# Altium project FLIGHTUmbilicalBoard_Rev1.PrjPcb
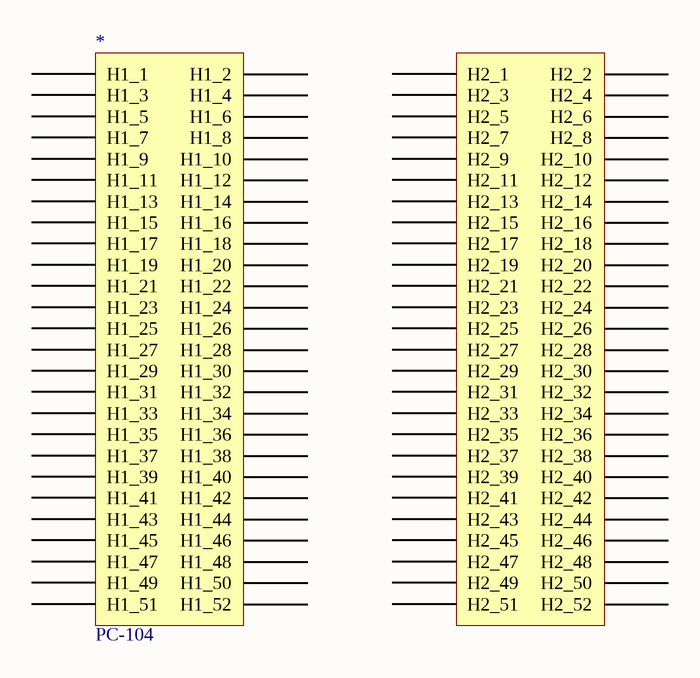
[diagram p0: PC104 Header.SchDoc]
12 sheets, 78 parts. Net scope: flat (ports and power ports of the same name join across sheets).
Board file: FLIGHTUmbilicalBoard_Rev1.PcbDoc
Sheets:
  PC104 Header.SchDoc
  TopSheet.SchDoc
  DCDC.SchDoc
  Propulsion.SchDoc
  ADCS.SchDoc
  Docking.SchDoc
  FlightComputer.SchDoc
  Rockblock.SchDoc
  CDGPS.SchDoc
  EPS.SchDoc
  IMU.SchDoc
  BarrelJack.SchDoc

## Sheet PC104 Header.SchDoc
size B

### Parts
*  PC-104  [PC-104FOOTPRINT]

### Nets

Not connected (* = marked no-connect by the designer): * H1_1 H1_2 H1_3 H1_4 H1_5 H1_6 H1_7 H1_8 H1_9 H1_10 H1_11 H1_12 H1_13 H1_14 H1_15 H1_16 H1_17 H1_18 H1_19 H1_20 H1_21 H1_22 H1_23 H1_24 H1_25 H1_26 H1_27 H1_28 H1_29 H1_30 H1_31 H1_32 H1_33 H1_34 H1_35 H1_36 H1_37 H1_38 H1_39 H1_40 H1_41 H1_42 H1_43 H1_44 H1_45 H1_46 H1_47 H1_48 H1_49 H1_50 H1_51 H1_52 H2_1 H2_2 H2_3 H2_4 H2_5 H2_6 H2_7 H2_8 H2_9 H2_10 H2_11 H2_12 H2_13 H2_14 H2_15 H2_16 H2_17 H2_18 H2_19 H2_20 H2_21 H2_22 H2_23 H2_24 H2_25 H2_26 H2_27 H2_28 H2_29 H2_30 H2_31 H2_32 H2_33 H2_34 H2_35 H2_36 H2_37 H2_38 H2_39 H2_40 H2_41 H2_42 H2_43 H2_44 H2_45 H2_46 H2_47 H2_48 H2_49 H2_50 H2_51 H2_52

## Sheet TopSheet.SchDoc: TopSheet
size A3; Author: Leah Forrest; CompanyName: Cornell SSDS; Organization: Cornell OAAN
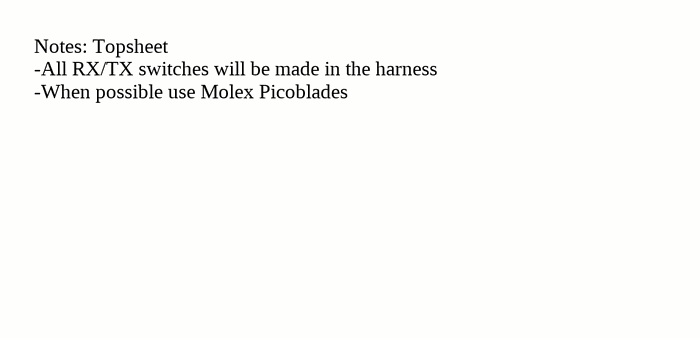
[diagram p1: TopSheet.SchDoc]

### Notes on the sheet
- Notes: Topsheet
  -All RX/TX switches will be made in the harness
  -When possible use Molex Picoblades
- Title
- Size:
- Date:
- A3
- Number:
- Time:
- Revision:
- Sheet
- of
- File:

## Sheet DCDC.SchDoc
size D
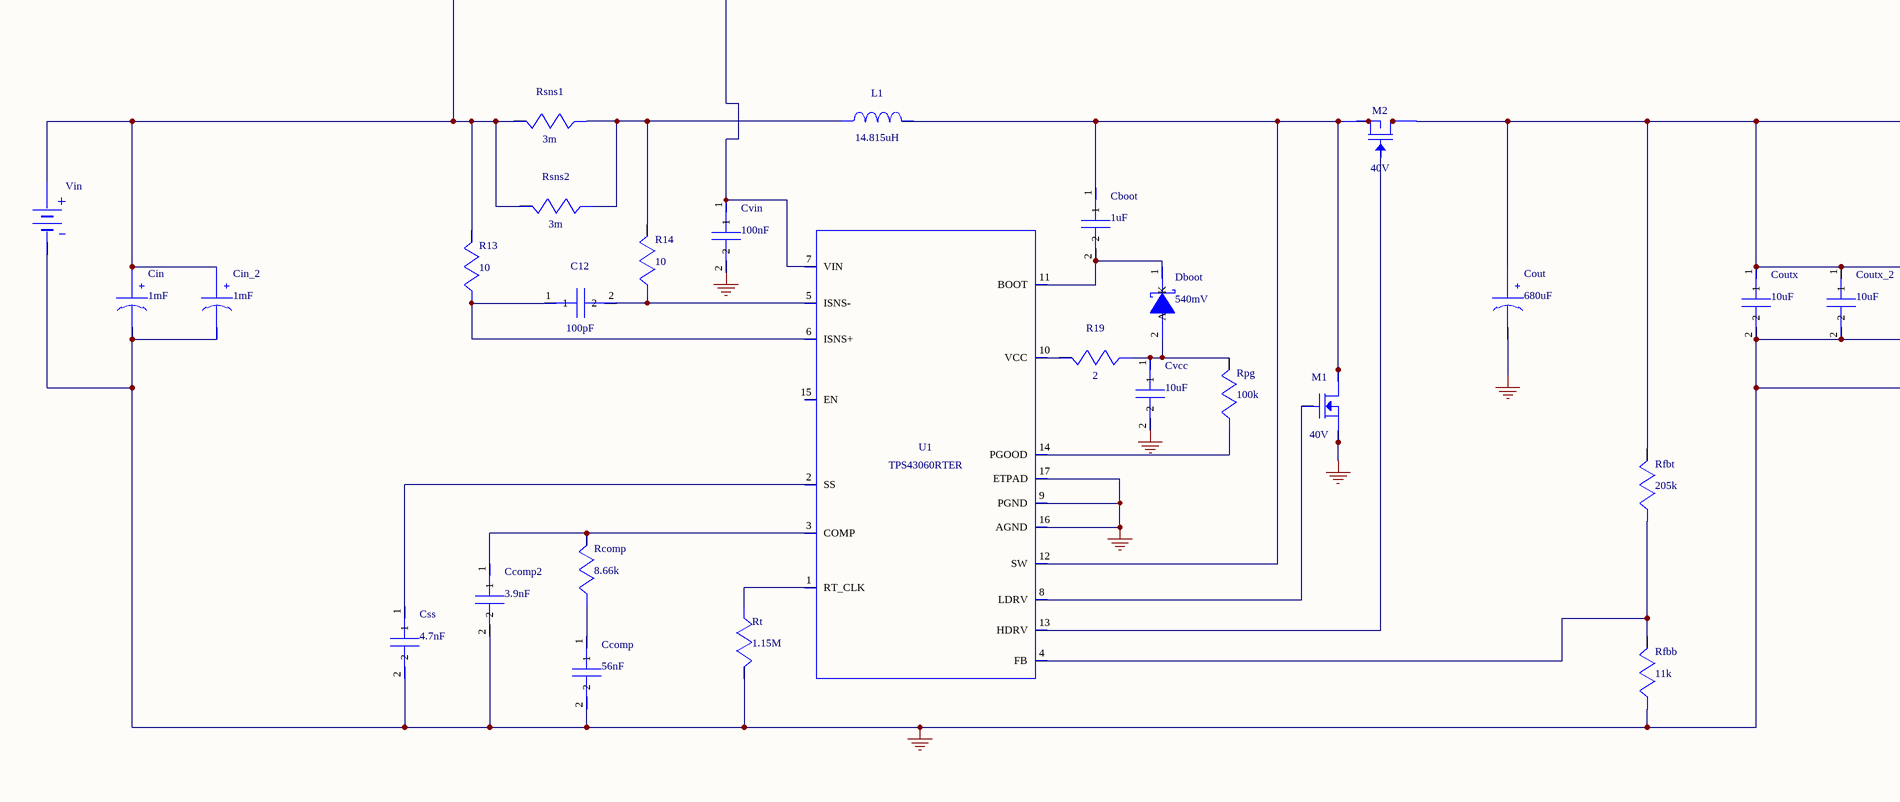
[diagram p2: DCDC.SchDoc, left]
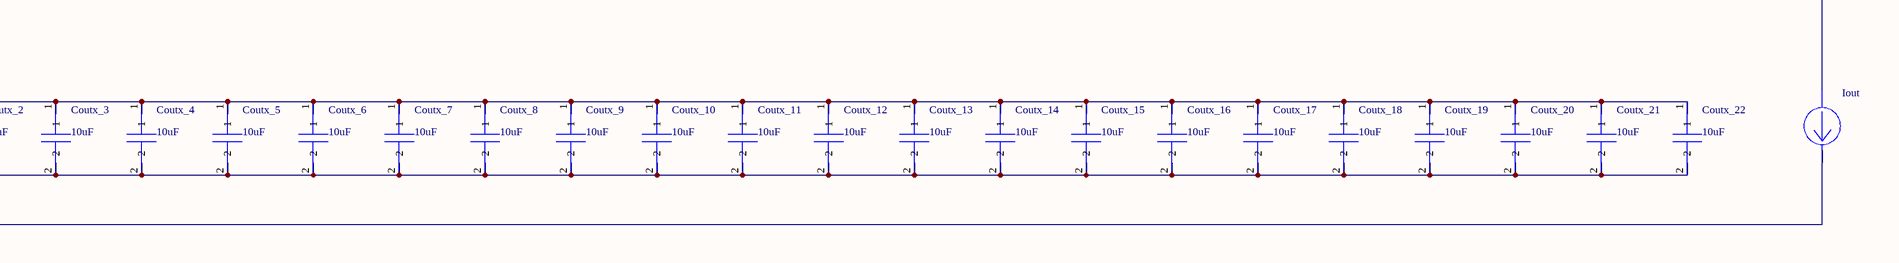
[diagram p3: DCDC.SchDoc, right]

### Parts
C12  value 100pF  (hidden comment: 06035A101JAT2A)
Cboot  value 1uF  (hidden comment: GRM188R61C105KA93D)
Ccomp  value 56nF  (hidden comment: GRM155R61A563KA01D)
Ccomp2  value 3.9nF  (hidden comment: CC0805KRX7R9BB392)
Cin  value 1mF  (hidden comment: 16SVPF1000M)
Cin_2  value 1mF  (hidden comment: 16SVPF1000M)
Cout  value 680uF  (hidden comment: EEV-FK1H681M)
Coutx  value 10uF  (hidden comment: C3216JB1H106K)
Coutx_2  value 10uF  (hidden comment: C3216JB1H106K)
Coutx_3  value 10uF  (hidden comment: C3216JB1H106K)
Coutx_4  value 10uF  (hidden comment: C3216JB1H106K)
Coutx_5  value 10uF  (hidden comment: C3216JB1H106K)
Coutx_6  value 10uF  (hidden comment: C3216JB1H106K)
Coutx_7  value 10uF  (hidden comment: C3216JB1H106K)
Coutx_8  value 10uF  (hidden comment: C3216JB1H106K)
Coutx_9  value 10uF  (hidden comment: C3216JB1H106K)
Coutx_10  value 10uF  (hidden comment: C3216JB1H106K)
Coutx_11  value 10uF  (hidden comment: C3216JB1H106K)
Coutx_12  value 10uF  (hidden comment: C3216JB1H106K)
Coutx_13  value 10uF  (hidden comment: C3216JB1H106K)
Coutx_14  value 10uF  (hidden comment: C3216JB1H106K)
Coutx_15  value 10uF  (hidden comment: C3216JB1H106K)
Coutx_16  value 10uF  (hidden comment: C3216JB1H106K)
Coutx_17  value 10uF  (hidden comment: C3216JB1H106K)
Coutx_18  value 10uF  (hidden comment: C3216JB1H106K)
Coutx_19  value 10uF  (hidden comment: C3216JB1H106K)
Coutx_20  value 10uF  (hidden comment: C3216JB1H106K)
Coutx_21  value 10uF  (hidden comment: C3216JB1H106K)
Coutx_22  value 10uF  (hidden comment: C3216JB1H106K)
Css  value 4.7nF  (hidden comment: GRM188R71E472KA01D)
Cvcc  value 10uF  (hidden comment: GRM188R61C106MA73D)
Cvin  value 100nF  (hidden comment: 08053C104KAT2A)
Dboot  value 540mV  (hidden comment: XBS104S13R-G)
Iout  WB_CURRENT_LOAD  (value not drawn)
L1  value 14.815uH  (hidden comment: GENERIC_INDUCTOR)
M1  value 40V  (hidden comment: FDMS8460)
M2  value 40V  (hidden comment: CSD18509Q5B)
R13  value 10  (hidden comment: CRCW040210R0FKED)
R14  value 10  (hidden comment: CRCW040210R0FKED)
R19  value 2  (hidden comment: CRCW04022R00FKED)
Rcomp  value 8.66k  (hidden comment: CRCW04028K66FKED)
Rfbb  value 11k  (hidden comment: CRCW040211K0FKED)
Rfbt  value 205k  (hidden comment: CRCW0402205KFKED)
Rpg  value 100k  (hidden comment: CRCW0402100KFKED)
Rsns1  value 3m  (hidden comment: WSR33L000FEA)
Rsns2  value 3m  (hidden comment: WSR33L000FEA)
Rt  value 1.15M  (hidden comment: CRCW04021M15FKED)
U1  TPS43060RTER
Vin  WB_BATTERY  (value not drawn)

### Nets
0: Ccomp.2 Ccomp2.2 Cin.2(-) Cin_2.2(-) Cout.2(-) Coutx.2 Coutx_2.2 Coutx_3.2 Coutx_4.2 Coutx_5.2 Coutx_6.2 Coutx_7.2 Coutx_8.2 Coutx_9.2 Coutx_10.2 Coutx_11.2 Coutx_12.2 Coutx_13.2 Coutx_14.2 Coutx_15.2 Coutx_16.2 Coutx_17.2 Coutx_18.2 Coutx_19.2 Coutx_20.2 Coutx_21.2 Coutx_22.2 Css.2 Cvcc.2 Cvin.2 Iout.2(-) M1.1(Source) M1.2(Source) M1.3(Source) Rfbb.2 Rt.1 U1.9(PGND) U1.16(AGND) U1.17(ETPAD) Vin.2(-)
NetC12_1: C12.1 R13.2 U1.6(ISNS+)
NetC12_2: C12.2 R14.2 U1.5(ISNS-)
NetCboot_1: Cboot.1 L1.1 M1.5(Drain) M1.6(Drain) M1.7(Drain) M1.8(Drain) U1.12(SW)
NetCboot_2: Cboot.2 Dboot.1(K) U1.11(BOOT)
NetCcomp2_1: Ccomp2.1 Rcomp.1 U1.3(COMP)
NetCcomp_1: Ccomp.1 Rcomp.2
NetCin_1: Cin.1(+) Cin_2.1(+) Cvin.1 R13.1 Rsns1.1 Rsns2.1 U1.7(VIN) Vin.1(+)
NetCout_1: Cout.1(+) Coutx.1 Coutx_2.1 Coutx_3.1 Coutx_4.1 Coutx_5.1 Coutx_6.1 Coutx_7.1 Coutx_8.1 Coutx_9.1 Coutx_10.1 Coutx_11.1 Coutx_12.1 Coutx_13.1 Coutx_14.1 Coutx_15.1 Coutx_16.1 Coutx_17.1 Coutx_18.1 Coutx_19.1 Coutx_20.1 Coutx_21.1 Coutx_22.1 Iout.1(+) Rfbt.1
NetCss_1: Css.1 U1.2(SS)
NetCvcc_1: Cvcc.1 Dboot.2(A) R19.2 Rpg.1
NetL1_2: L1.2 R14.1 Rsns1.2 Rsns2.2
NetM1_4: M1.4(Gate) U1.8(LDRV)
NetM2_1: M2.1(Source) M2.2(Source) M2.3(Source)
NetM2_4: M2.4(Gate) U1.13(HDRV)
NetM2_5: M2.5(Drain) M2.6(Drain) M2.7(Drain) M2.8(Drain) M2.9(Drain)
NetR19_1: R19.1 U1.10(VCC)
NetRfbb_1: Rfbb.1 Rfbt.2 U1.4(FB)
NetRpg_2: Rpg.2 U1.14(PGOOD)
NetRt_2: Rt.2 U1.1(RT_CLK)

Not connected (* = marked no-connect by the designer): U1 15(EN)

### Library data of the parts
C12 = 06035A101JAT2A: Manufacturer Name: AVX; PackageReference: 06035A101JAT2A; Manufacturer Part Number: 06035A101JAT2A
Cboot = GRM188R61C105KA93D: GRM188R61C105KA9; Manufacturer Name: MuRata; PackageReference: GRM188R61C105KA93D; Manufacturer Part Number: GRM188R61C105KA93D
Ccomp = GRM155R61A563KA01D: GRM155R61A563KA0; Manufacturer Name: MuRata; PackageReference: GRM155R61A563KA01D; Manufacturer Part Number: GRM155R61A563KA01D
Ccomp2 = CC0805KRX7R9BB392: CC0805KRX7R9BB39; Manufacturer Name: Yageo America; PackageReference: CC0805KRX7R9BB392; Manufacturer Part Number: CC0805KRX7R9BB392
Cin Cin_2 = 16SVPF1000M: Manufacturer Name: Panasonic; PackageReference: 16SVPF1000M; Manufacturer Part Number: 16SVPF1000M
Cout = EEV-FK1H681M: Manufacturer Name: Panasonic; PackageReference: EEV-FK1H681M; Manufacturer Part Number: EEV-FK1H681M
Coutx Coutx_2-Coutx_22 = C3216JB1H106K: Manufacturer Name: TDK; PackageReference: C3216JB1H106K; Manufacturer Part Number: C3216JB1H106K
Css = GRM188R71E472KA01D: GRM188R71E472KA0; Manufacturer Name: MuRata; PackageReference: GRM188R71E472KA01D; Manufacturer Part Number: GRM188R71E472KA01D
Cvcc = GRM188R61C106MA73D: GRM188R61C106MA7; Manufacturer Name: MuRata; PackageReference: GRM188R61C106MA73D; Manufacturer Part Number: GRM188R61C106MA73D
Cvin = 08053C104KAT2A: Manufacturer Name: AVX; PackageReference: 08053C104KAT2A; Manufacturer Part Number: 08053C104KAT2A
Dboot = XBS104S13R-G: Manufacturer Name: Torex USA Corporation; PackageReference: XBS104S13R-G; Manufacturer Part Number: XBS104S13R-G
L1 = GENERIC_INDUCTOR: CUSTOM1; Manufacturer Name: CUSTOM; PackageReference: CUSTOM; Manufacturer Part Number: GENERIC_INDUCTOR
M1 = FDMS8460: Manufacturer Name: Fairchild Semiconductor; PackageReference: FDMS8460; Manufacturer Part Number: FDMS8460
M2 = CSD18509Q5B: Manufacturer Name: Texas Instruments; PackageReference: CSD18509Q5B; Manufacturer Part Number: CSD18509Q5B
R13 R14 = CRCW040210R0FKED: Manufacturer Name: Vishay-Dale; PackageReference: CRCW040210R0FKED; Manufacturer Part Number: CRCW040210R0FKED
R19 = CRCW04022R00FKED: Manufacturer Name: Vishay-Dale; PackageReference: CRCW04022R00FKED; Manufacturer Part Number: CRCW04022R00FKED
Rcomp = CRCW04028K66FKED: Manufacturer Name: Vishay-Dale; PackageReference: CRCW04028K66FKED; Manufacturer Part Number: CRCW04028K66FKED
Rfbb = CRCW040211K0FKED: Manufacturer Name: Vishay-Dale; PackageReference: CRCW040211K0FKED; Manufacturer Part Number: CRCW040211K0FKED
Rfbt = CRCW0402205KFKED: Manufacturer Name: Vishay-Dale; PackageReference: CRCW0402205KFKED; Manufacturer Part Number: CRCW0402205KFKED
Rpg = CRCW0402100KFKED: Manufacturer Name: Vishay-Dale; PackageReference: CRCW0402100KFKED; Manufacturer Part Number: CRCW0402100KFKED
Rsns1 Rsns2 = WSR33L000FEA: Manufacturer Name: Vishay-Dale; PackageReference: WSR33L000FEA; Manufacturer Part Number: WSR33L000FEA
Rt = CRCW04021M15FKED: Manufacturer Name: Vishay-Dale; PackageReference: CRCW04021M15FKED; Manufacturer Part Number: CRCW04021M15FKED
U1 = TPS43060RTER: Manufacturer Name: Texas Instruments; PackageReference: TPS43060RTER; Manufacturer Part Number: TPS43060RTER; Value: Value
Iout = WB_CURRENT_LOAD: PackageReference: WB_CURRENT_LOAD; Manufacturer Part Number: WB_CURRENT_LOAD; Manufacturer Name: WB_CURRENT_LOAD; Value: N/A
Vin = WB_BATTERY: PackageReference: WB_BATTERY; Manufacturer Part Number: WB_BATTERY; Manufacturer Name: WB_BATTERY; Value: N/A

## Sheet Propulsion.SchDoc
size C
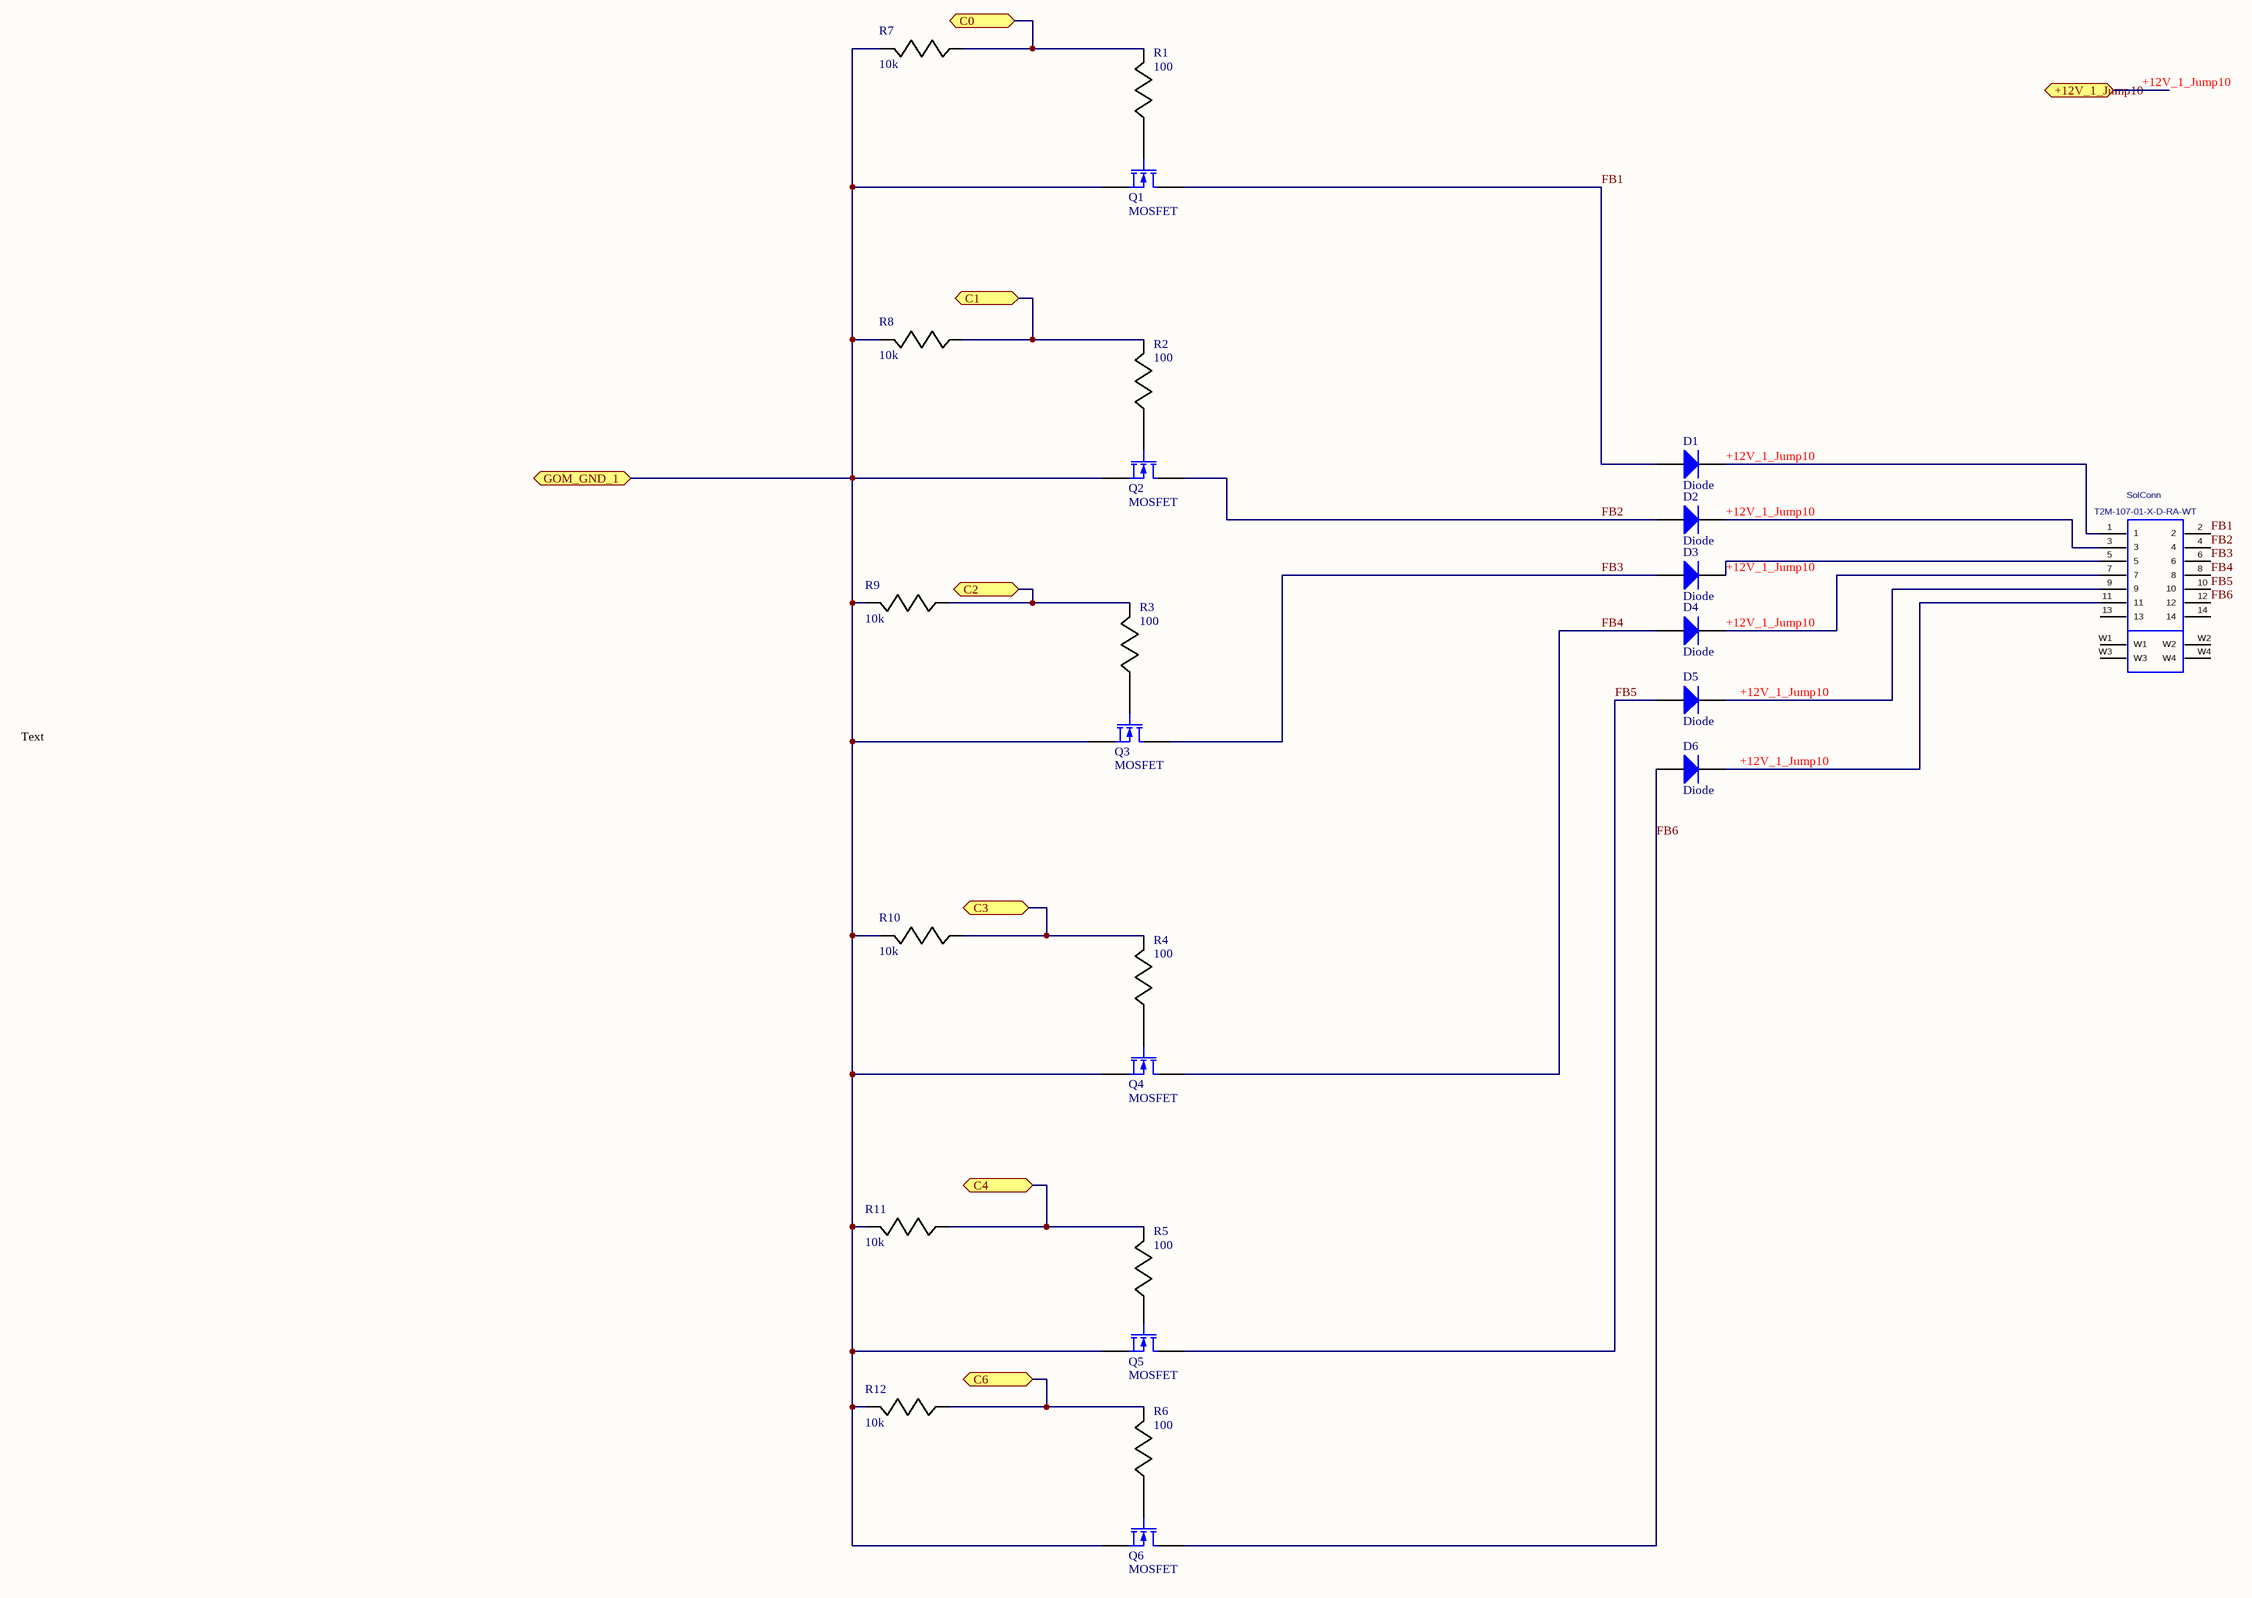
[diagram p4: Propulsion.SchDoc]

### Parts
D1  Diode  [SMC]
D2  Diode  [SMC]
D3  Diode  [SMC]
D4  Diode  [SMC]
D5  Diode  [SMC]
D6  Diode  [SMC]
Q1  MOSFET  [TO-226-AA]
Q2  MOSFET  [TO-226-AA]
Q3  MOSFET  [TO-226-AA]
Q4  MOSFET  [TO-226-AA]
Q5  MOSFET  [TO-226-AA]
Q6  MOSFET  [TO-226-AA]
R1  100  [AXIAL-0.3]
R2  100  [AXIAL-0.3]
R3  100  [AXIAL-0.3]
R4  100  [AXIAL-0.3]
R5  100  [AXIAL-0.3]
R6  100  [AXIAL-0.3]
R7  10k  [AXIAL-0.3]
R8  10k  [AXIAL-0.3]
R9  10k  [AXIAL-0.3]
R10  10k  [AXIAL-0.3]
R11  10k  [AXIAL-0.3]
R12  10k  [AXIAL-0.3]
SolConn  T2M-107-01-X-D-RA-WT  [T2M-107-01-X-D-RA-WT]

### Ports
+12V_1_Jump10 (bidir), C0 (bidir), C1 (bidir), C2 (bidir), C3 (bidir), C4 (bidir), C6 (bidir), GOM_GND_1 (bidir)

### Nets
+12V_1_Jump10: D1.2(K) D2.2(K) D3.2(K) D4.2(K) D5.2(K) D6.2(K) SolConn.1 SolConn.3 SolConn.5 SolConn.7 SolConn.9 SolConn.11 ; port +12V_1_Jump10
FB1: D1.1(A) Q1.1(D) SolConn.2
FB2: D2.1(A) Q2.1(D) SolConn.4
FB3: D3.1(A) Q3.1(D) SolConn.6
FB4: D4.1(A) Q4.1(D) SolConn.8
FB5: D5.1(A) Q5.1(D) SolConn.10
FB6: D6.1(A) Q6.1(D) SolConn.12
GOM_GND_1: Q1.3(S) Q2.3(S) Q3.3(S) Q4.3(S) Q5.3(S) Q6.3(S) R7.1 R8.1 R9.1 R10.1 R11.1 R12.1 ; port GOM_GND_1
NetQ1_2: Q1.2(G) R1.2
NetQ2_2: Q2.2(G) R2.2
NetQ3_2: Q3.2(G) R3.2
NetQ4_2: Q4.2(G) R4.2
NetQ6_2: Q6.2(G) R6.2
NetR1_1: R1.1 R7.2 ; port C0
NetR2_1: R2.1 R8.2 ; port C1
NetR3_1: R3.1 R9.2 ; port C2
NetR4_1: R4.1 R10.2 ; port C3
NetR5_1: R5.1 R11.2 ; port C4
NetR6_1: R6.1 R12.2 ; port C6

Not connected (* = marked no-connect by the designer): Q5 2(G); R5 2; SolConn 13 14 W1 W2 W3 W4

### Notes on the sheet
- Text

### Library data of the parts
D1-D6 = Diode: Default Diode; Published: 8-Jun-2000; LatestRevisionDate: 17-Jul-2002; LatestRevisionNote: Re-released for DXP Platform.; PackageVersion: Sep-1996; PackageReference: SMC; Publisher: Altium Limited; PackageDescription: DO-214-AB/SMC; 2 C-Bend Leads; Body 7.9 x 5.9 mm, inc. leads (LxW); Code_JEDEC: DO-214-AB
Q1-Q6 = MOSFET-N: N-Channel MOSFET; Published: 8-Jun-2000; LatestRevisionDate: 17-Jul-2002; LatestRevisionNote: Re-released for DXP Platform.; PackageVersion: 1995/1996; PackageReference: E3; Publisher: Altium Limited; PackageDescription: TO, Flat Index; 3 In-Line, Axial Leads; Body Dia. 4.6mm; Lead Dia. 0.5 mm (max)
R1-R12 = PMR100HZPFU6L00: Imported; Vendor: Rohm; Value: 6m; Manufacturer_Part_Number: PMR100HZPFU6L00; Manufacturer_Name: Rohm; RefDes: RefDes; TYPE: TYPE
SolConn = T2M-107-01-X-D-RA-WT: 2MM PITCH SHROUDED RIGHT ANGLE TERMINAL STRIP.; MANUFACTURER: SAMTEC; CREATED: September 24, 2014 - Wendy Xin; PCB DECAL: T2M-107-01-X-D-RA-WT

## Sheet ADCS.SchDoc
size A
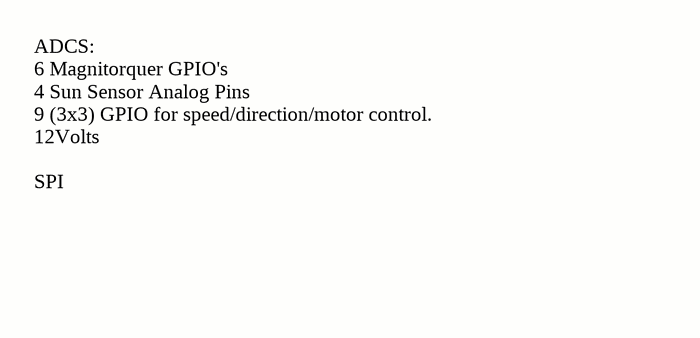
[diagram p5: ADCS.SchDoc]

### Notes on the sheet
- ADCS:
  6 Magnitorquer GPIO's
  4 Sun Sensor Analog Pins
  9 (3x3) GPIO for speed/direction/motor control.
  12Volts
  SPI

## Sheet Docking.SchDoc
size A
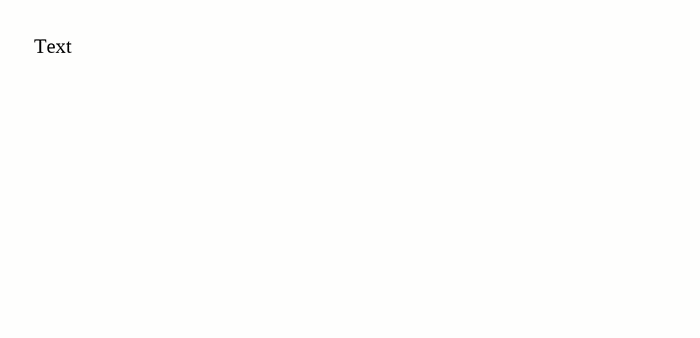
[diagram p6: Docking.SchDoc]

### Notes on the sheet
- Text

## Sheet FlightComputer.SchDoc
size B
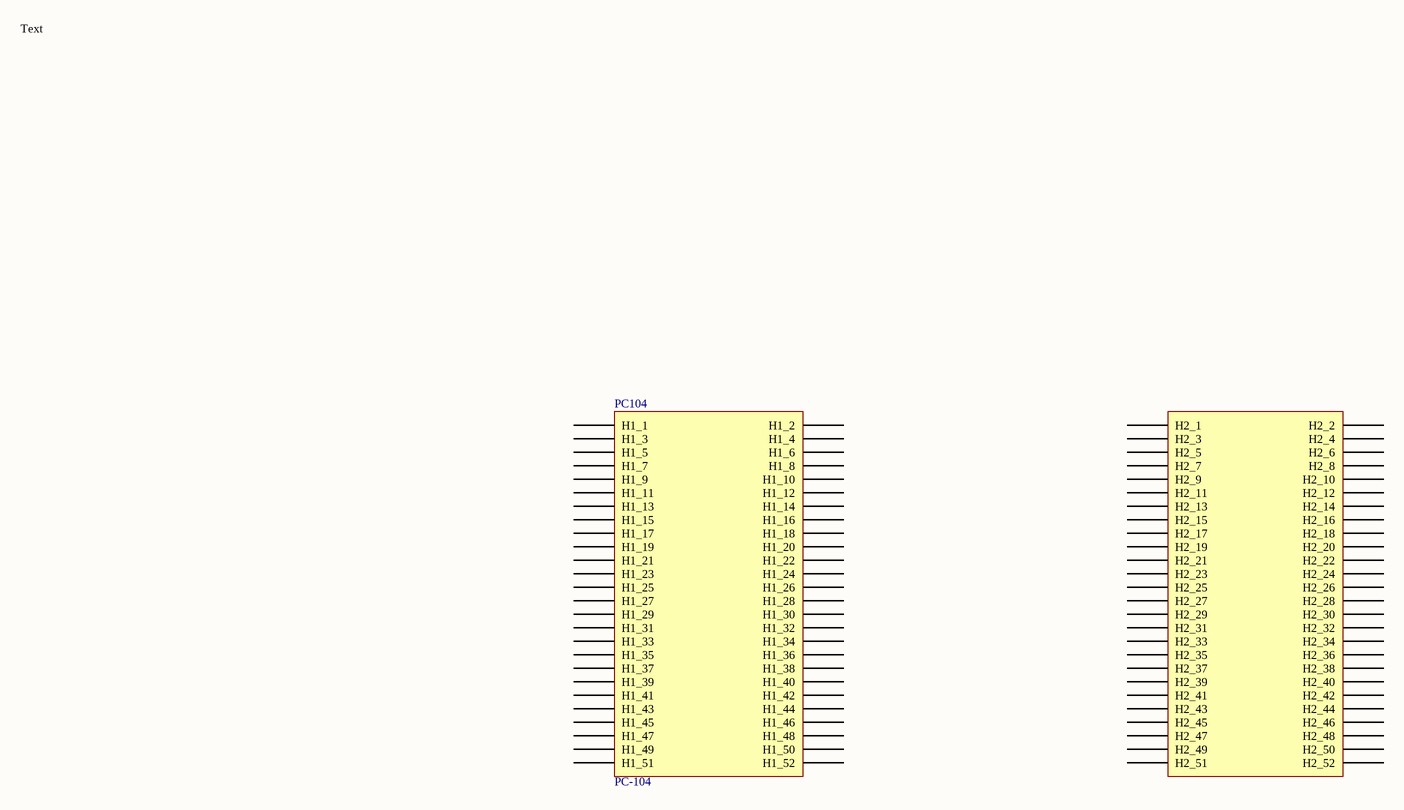
[diagram p7: FlightComputer.SchDoc]

### Parts
PC104  PC-104  [PC-104FOOTPRINT]

### Nets

Not connected (* = marked no-connect by the designer): PC104 H1_1 H1_2 H1_3 H1_4 H1_5 H1_6 H1_7 H1_8 H1_9 H1_10 H1_11 H1_12 H1_13 H1_14 H1_15 H1_16 H1_17 H1_18 H1_19 H1_20 H1_21 H1_22 H1_23 H1_24 H1_25 H1_26 H1_27 H1_28 H1_29 H1_30 H1_31 H1_32 H1_33 H1_34 H1_35 H1_36 H1_37 H1_38 H1_39 H1_40 H1_41 H1_42 H1_43 H1_44 H1_45 H1_46 H1_47 H1_48 H1_49 H1_50 H1_51 H1_52 H2_1 H2_2 H2_3 H2_4 H2_5 H2_6 H2_7 H2_8 H2_9 H2_10 H2_11 H2_12 H2_13 H2_14 H2_15 H2_16 H2_17 H2_18 H2_19 H2_20 H2_21 H2_22 H2_23 H2_24 H2_25 H2_26 H2_27 H2_28 H2_29 H2_30 H2_31 H2_32 H2_33 H2_34 H2_35 H2_36 H2_37 H2_38 H2_39 H2_40 H2_41 H2_42 H2_43 H2_44 H2_45 H2_46 H2_47 H2_48 H2_49 H2_50 H2_51 H2_52

### Notes on the sheet
- Text

## Sheet Rockblock.SchDoc
size A
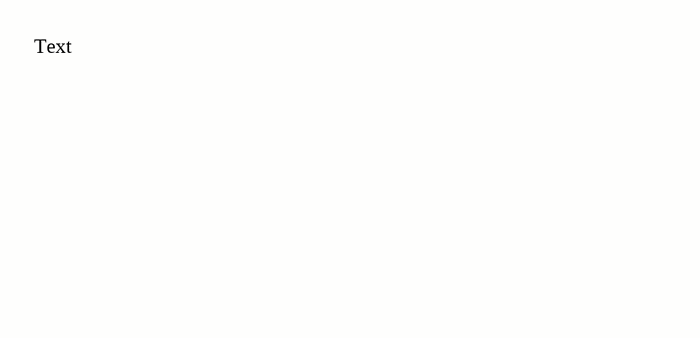
[diagram p8: Rockblock.SchDoc]

### Notes on the sheet
- Text

## Sheet CDGPS.SchDoc
size A
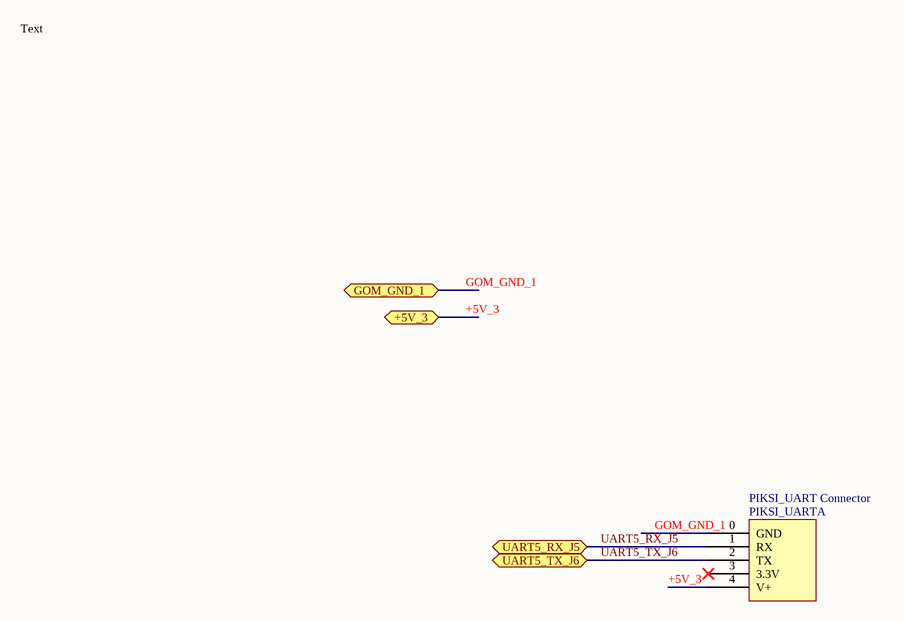
[diagram p9: CDGPS.SchDoc]

### Parts
PIKSI_UARTA  PIKSI_UART Connector  [Molex Picoblade 5 Pin]

### Ports
+5V_3 (bidir), GOM_GND_1 (bidir), UART5_RX_J5 (bidir), UART5_TX_J6 (bidir)

### Nets
+5V_3: PIKSI_UARTA.4(V+) ; port +5V_3
GOM_GND_1: PIKSI_UARTA.0(GND) ; port GOM_GND_1
UART5_RX_J5: PIKSI_UARTA.1(RX) ; port UART5_RX_J5
UART5_TX_J6: PIKSI_UARTA.2(TX) ; port UART5_TX_J6

Not connected (* = marked no-connect by the designer): PIKSI_UARTA 3(3.3V)*

### Notes on the sheet
- Text

### Library data of the parts
PIKSI_UARTA = PIKSI_UART Connector: Molex Picoblade 5 Pin

## Sheet EPS.SchDoc
size A
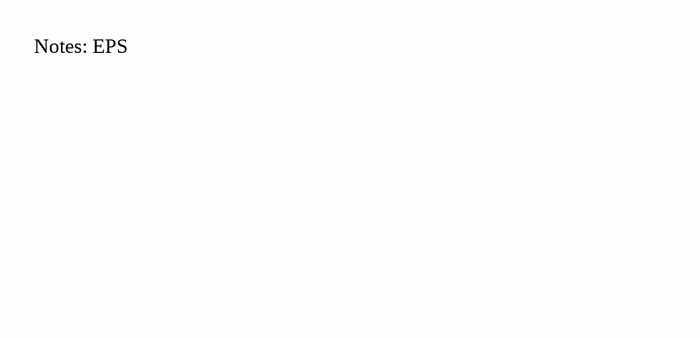
[diagram p10: EPS.SchDoc]

### Notes on the sheet
- Notes: EPS

## Sheet IMU.SchDoc
size B
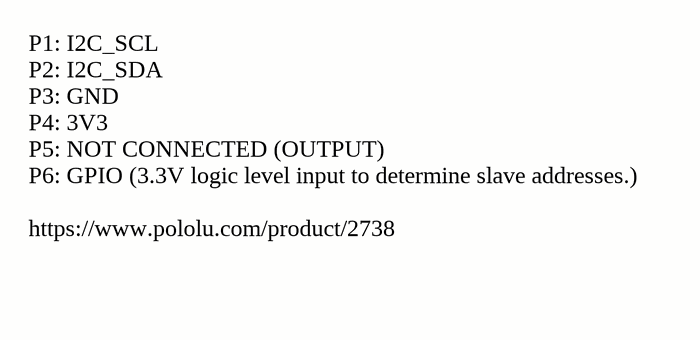
[diagram p11: IMU.SchDoc]

### Notes on the sheet
- P1: I2C_SCL
  P2: I2C_SDA
  P3: GND
  P4: 3V3
  P5: NOT CONNECTED (OUTPUT)
  P6: GPIO (3.3V logic level input to determine slave addresses.)
  https://www.pololu.com/product/2738

## Sheet BarrelJack.SchDoc
size A
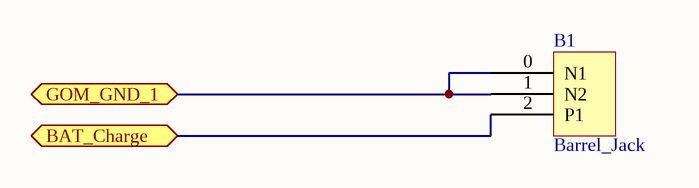
[diagram p12: BarrelJack.SchDoc]

### Parts
B1  Barrel_Jack  [Barrel_Jack]

### Ports
BAT_Charge (bidir), GOM_GND_1 (bidir)

### Nets
GOM_GND_1: B1.0(N1) B1.1(N2) ; port GOM_GND_1
NetB1_2: B1.2(P1) ; port BAT_Charge

## Nets that join several sheets
GOM_GND_1: Propulsion (12 pins), CDGPS (PIKSI_UARTA.0), BarrelJack (B1.0 B1.1)